# EAGLE design SMTRelayControllerDense (EAGLE 7.3.0)
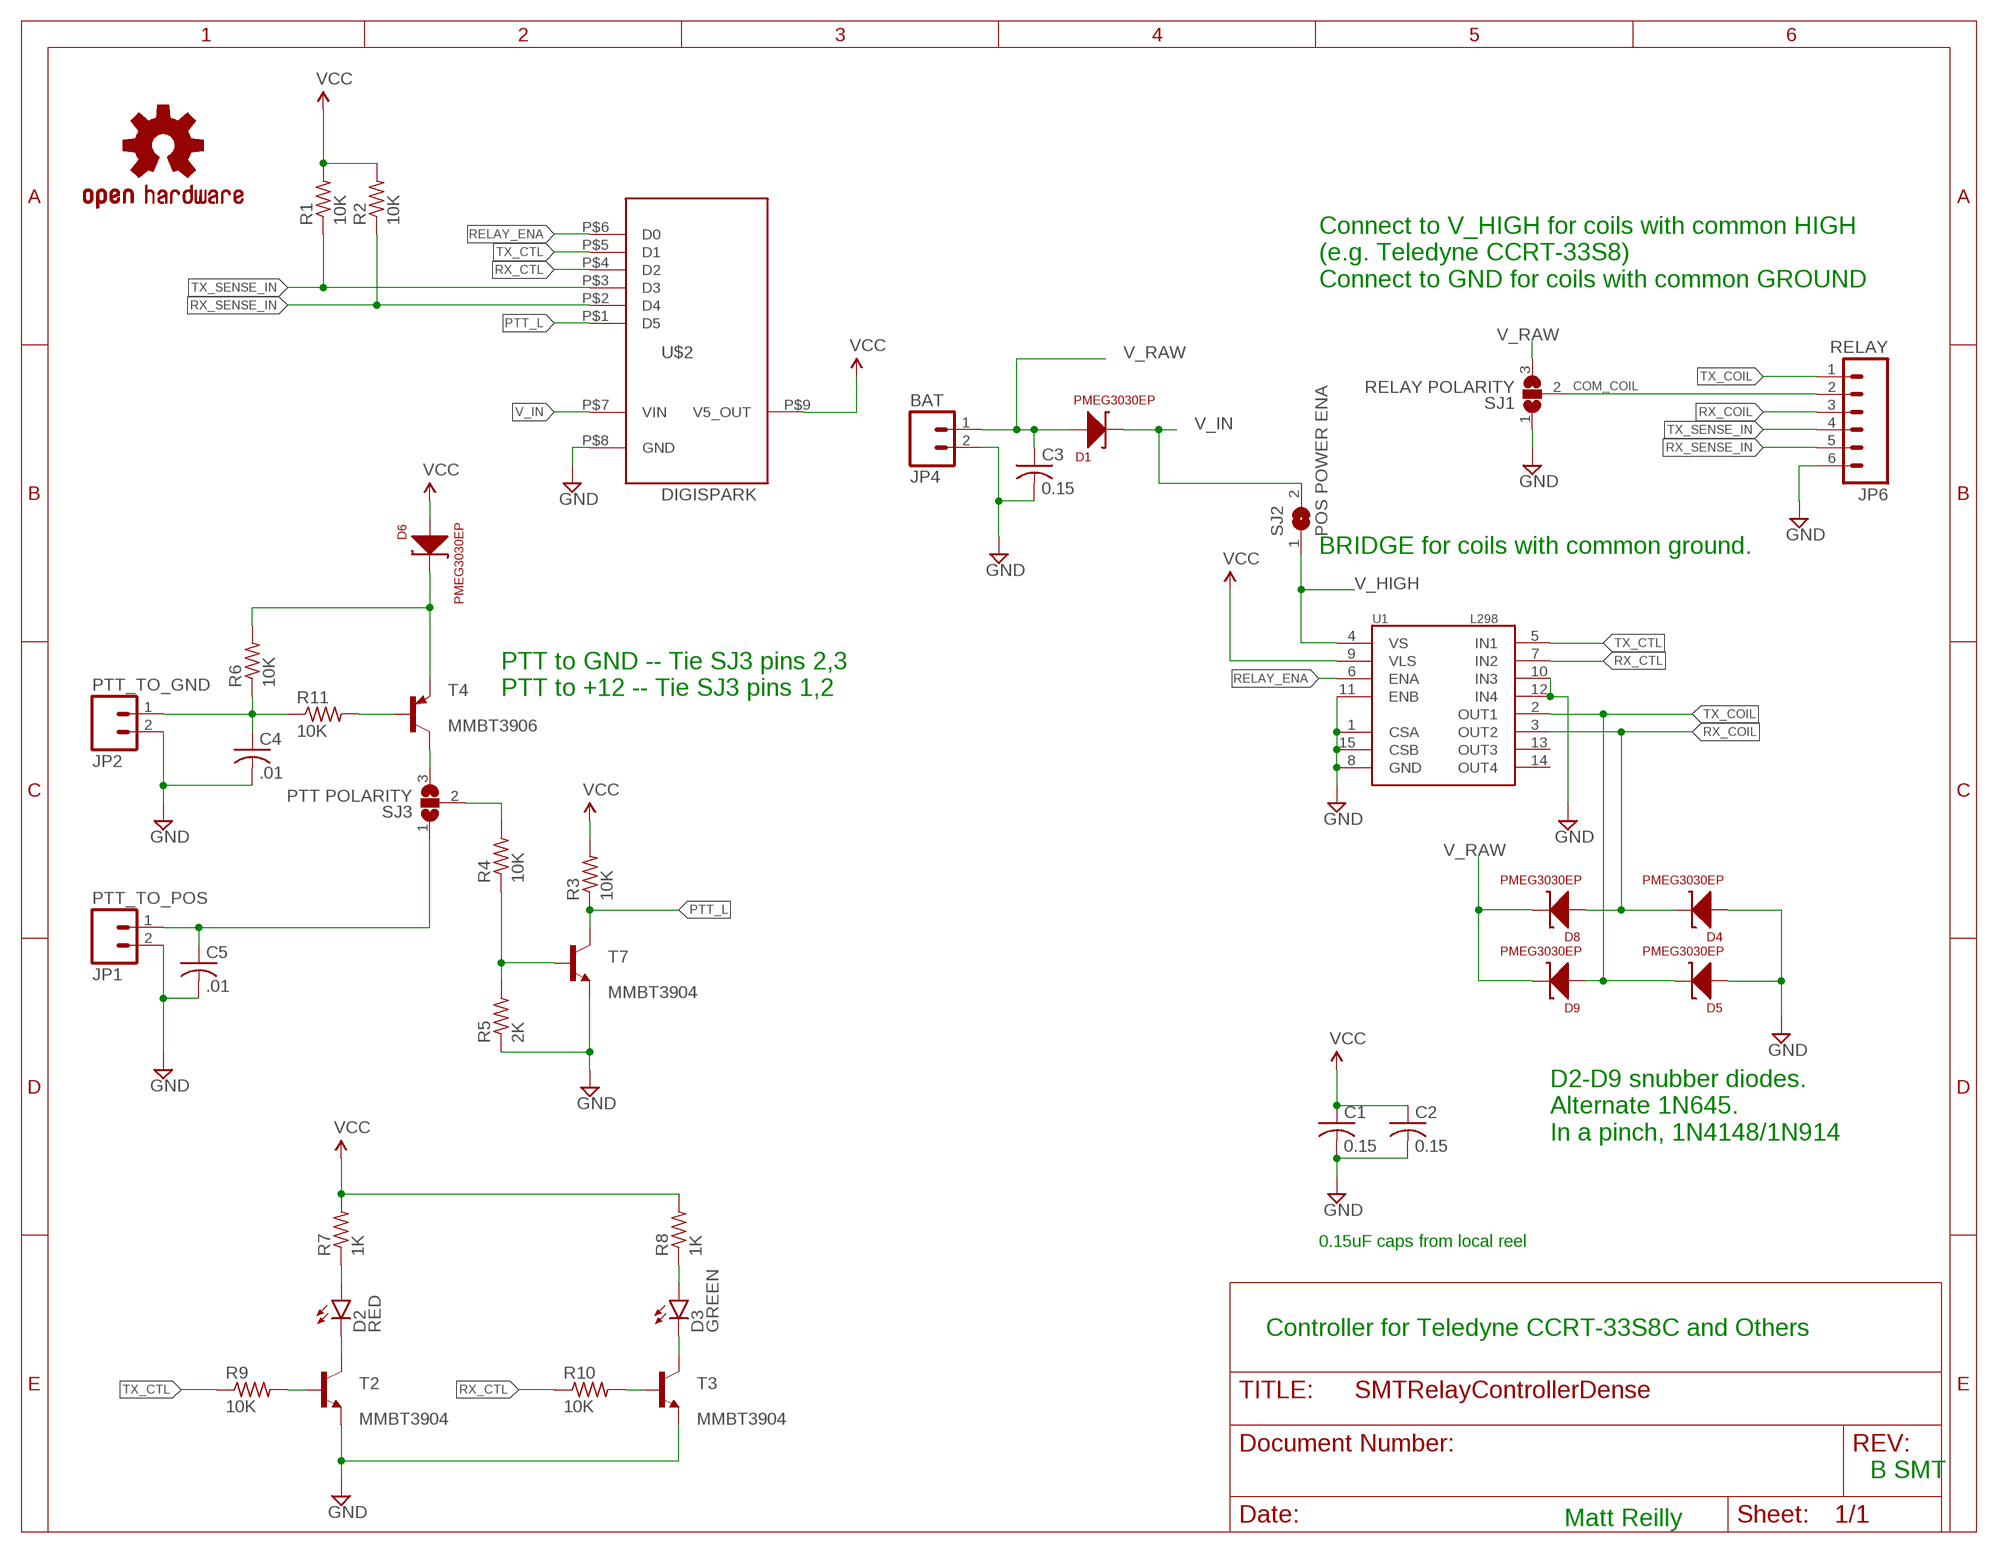
[diagram p0: schematic, sheet 1]

## Parts
C1  0.15  C-USC1206K  [C1206K]
C2  0.15  C-USC1206K  [C1206K]
C3  0.15  C-USC1206K  [C1206K]
C4  .01  C-USC1206K  [C1206K]
C5  .01  C-USC1206K  [C1206K]
D1  PMEG3030EP  [SOD128]
D2  RED  LED1206  [LED-1206]
D3  GREEN  LED1206  [LED-1206]
D4  PMEG3030EP  [SOD128]
D5  PMEG3030EP  [SOD128]
D6  PMEG3030EP  [SOD128]
D8  PMEG3030EP  [SOD128]
D9  PMEG3030EP  [SOD128]
JP1  PTT_TO_POS  M025MM  [SCREWTERMINAL-5MM-2]
JP2  PTT_TO_GND  M025MM  [SCREWTERMINAL-5MM-2]
JP4  BAT  M025MM  [SCREWTERMINAL-5MM-2]
JP6  RELAY  M06POLAR  [MOLEX-1X6]
LOGO2  OSHW-LOGOM  [OSHW-LOGO-M]
R1  10K  R-US_R1206  [R1206]
R2  10K  R-US_R1206  [R1206]
R3  10K  R-US_R1206  [R1206]
R4  10K  R-US_R1206  [R1206]
R5  2K  R-US_R1206  [R1206]
R6  10K  R-US_R1206  [R1206]
R7  1K  R-US_R1206  [R1206]
R8  1K  R-US_R1206  [R1206]
R9  10K  R-US_R1206  [R1206]
R10  10K  R-US_R1206  [R1206]
R11  10K  R-US_R1206  [R1206]
SJ1  RELAY POLARITY  SJ2WW  [SJ_2W]
SJ2  POS POWER ENA  SJW  [SJW]
SJ3  PTT POLARITY  SJ2WW  [SJ_2W]
T2  MMBT3904  MMBT3904LT1-NPN-SOT23-BEC  [SOT23-BEC]
T3  MMBT3904  MMBT3904LT1-NPN-SOT23-BEC  [SOT23-BEC]
T4  MMBT3906  MMBT3906LT1-PNP-SOT23-BEC  [SOT23-BEC]
T7  MMBT3904  MMBT3904LT1-NPN-SOT23-BEC  [SOT23-BEC]
U1  L298  [MULTIWATT15]
U$2  DIGISPARK  [DIGISPARK_FP]

## Nets
COM_COIL: JP6.2 SJ1.2
GND: C1.2 C2.2 C3.2 C4.2 C5.2 D4.P$1(A) D5.P$1(A) JP1.2 JP2.2 JP4.2 JP6.6 R5.1 SJ1.1 T2.E T3.E T7.E U1.1(CSA) U1.8(GND) U1.10(IN3) U1.11(ENB) U1.12(IN4) U1.15(CSB) U$2.P$8(GND)
N$1: C5.1 JP1.1 SJ3.1
N$2: R4.2 SJ3.2
N$3: D3.A R8.1
N$4: R4.1 R5.2 T7.B
N$5: R11.2 T4.B
N$6: D2.A R7.1
N$7: D2.C T2.C
N$8: D3.C T3.C
N$9: R9.2 T2.B
N$10: R10.2 T3.B
N$11: C4.1 JP2.1 R6.1 R11.1
N$12: D6.P$2(C) R6.2 T4.E
N$13: SJ3.3 T4.C
PTT_L: R3.1 T7.C U$2.P$1(D5)
RELAY_ENA: U1.6(ENA) U$2.P$6(D0)
RX_COIL: D4.P$2(C) D8.P$1(A) JP6.3 U1.3(OUT2)
RX_CTL: R10.1 U1.7(IN2) U$2.P$4(D2)
RX_SENSE_IN: JP6.5 R2.1 U$2.P$2(D4)
TX_COIL: D5.P$2(C) D9.P$1(A) JP6.1 U1.2(OUT1)
TX_CTL: R9.1 U1.5(IN1) U$2.P$5(D1)
TX_SENSE_IN: JP6.4 R1.1 U$2.P$3(D3)
V_HIGH: SJ2.1 U1.4(VS)
V_IN: D1.P$2(C) SJ2.2 U$2.P$7(VIN)
V_RAW: C3.1 D1.P$1(A) D8.P$2(C) D9.P$2(C) JP4.1 SJ1.3
VCC: C1.1 C2.1 D6.P$1(A) R1.2 R2.2 R3.2 R7.2 R8.2 U1.9(VLS) U$2.P$9(V5_OUT)
Unconnected: U1.13(OUT3) U1.14(OUT4)

## Notes on the sheet
- Connect to V_HIGH for coils with common HIGH
  (e.g. Teledyne CCRT-33S8)
  Connect to GND for coils with common GROUND
- BRIDGE for coils with common ground.
- PTT to GND -- Tie SJ3 pins 2,3
  PTT to +12 -- Tie SJ3 pins 1,2
- D2-D9 snubber diodes. 
  Alternate 1N645. 
  In a pinch, 1N4148/1N914
- 0.15uF caps from local reel
- Controller for Teledyne CCRT-33S8C and Others
- B SMT
- Matt Reilly

## Library data of the parts
C1-C5 = resistor:C-US: CAPACITOR, American symbol
D1 D4-D6 D8 D9 = kb1vc_robot_parts:PMEG3030EP
D2 D3 = SparkFun-LED:LED: LEDs Standard schematic elements and footprints for 5mm, 3mm, 1206, and 0603 sized LEDs. 5mm - Spark Fun Electronics SKU : COM-00529 (and others)
JP1 JP2 JP4 = SparkFun-Connectors:M02: Standard 2-pin 0.1" header. Use with - straight break away headers ( PRT-00116) - right angle break away headers (PRT-00553) - swiss pins (PRT-00743) - machine pins (PRT-00117) - female headers (PRT-00115) Molex polarized connector foot print use with: PRT-08233 with associated crimp pins and housings. 2.54_SCREWTERM for use with PRT-10571. 3.5mm Screw Terminal footprints for PRT-08084 5mm Screw Terminal footprints for use with PRT-08432; STOREFRONT_ID: PRT-08432
JP6 = SparkFun-Connectors:M06: Header 6 Standard 6-pin 0.1" header. Use with straight break away headers (SKU : PRT-00116), right angle break away headers (PRT-00553), swiss pins (PRT-00743), machine pins (PRT-00117), and female headers (PRT-00115). Molex polarized connector foot print use with SKU : PRT-08094 with associated crimp pins and housings. NOTES ON THE VARIANTS LOCK and LOCK_LONGPADS... This footprint was designed to help hold the alignment of a through-hole component (i.e. 6-pin header) while soldering it into place. You may notice that each hole has been shifted either up or down by 0.005 of an inch from it's more standard position (which is a perfectly straight line). This slight alteration caused the pins (the squares in the middle) to touch the edges of the holes. Because they are alternating, it causes a "brace" to hold the component in place. 0.005 has proven to be the perfect amount of "off-center" position when using our standard breakaway headers. Although looks a little odd when you look at the bare footprint, once you have a header in there, the alteration is very hard to notice. Also,if you push a header all the way into place, it is covered up entirely on the bottom side. This idea of altering the position of holes to aid alignment will be further integrated into the Sparkfun Library for other footprints. It can help hold any component with 3 or more connection pins.
LOGO2 = SparkFun-Aesthetics:OSHW-LOGO: Open Source Hardware Logo This logo indicates the piece of hardware it is found on incorporates a OSHW license and/or adheres to the definition of open source hardware found here: http://freedomdefined.org/OSHW
R1-R11 = rcl:R-US_: RESISTOR, American symbol
SJ1 SJ3 = jumper:SJ2W: SMD solder JUMPER
SJ2 = jumper:SJ: SMD solder JUMPER
T2 T3 T7 = transistor-neu-to92:*-NPN-: NPN Transistror
T4 = transistor-neu-to92:*-PNP-: PNP Transistror
U1 = SparkFun-PowerIC:L298: L298 Dual Full Bridge Driver
U$2 = kb1vc_Arduino_Parts:DIGISPARK: Digispark -- ATTiny arduino with minimal footprint

## Board
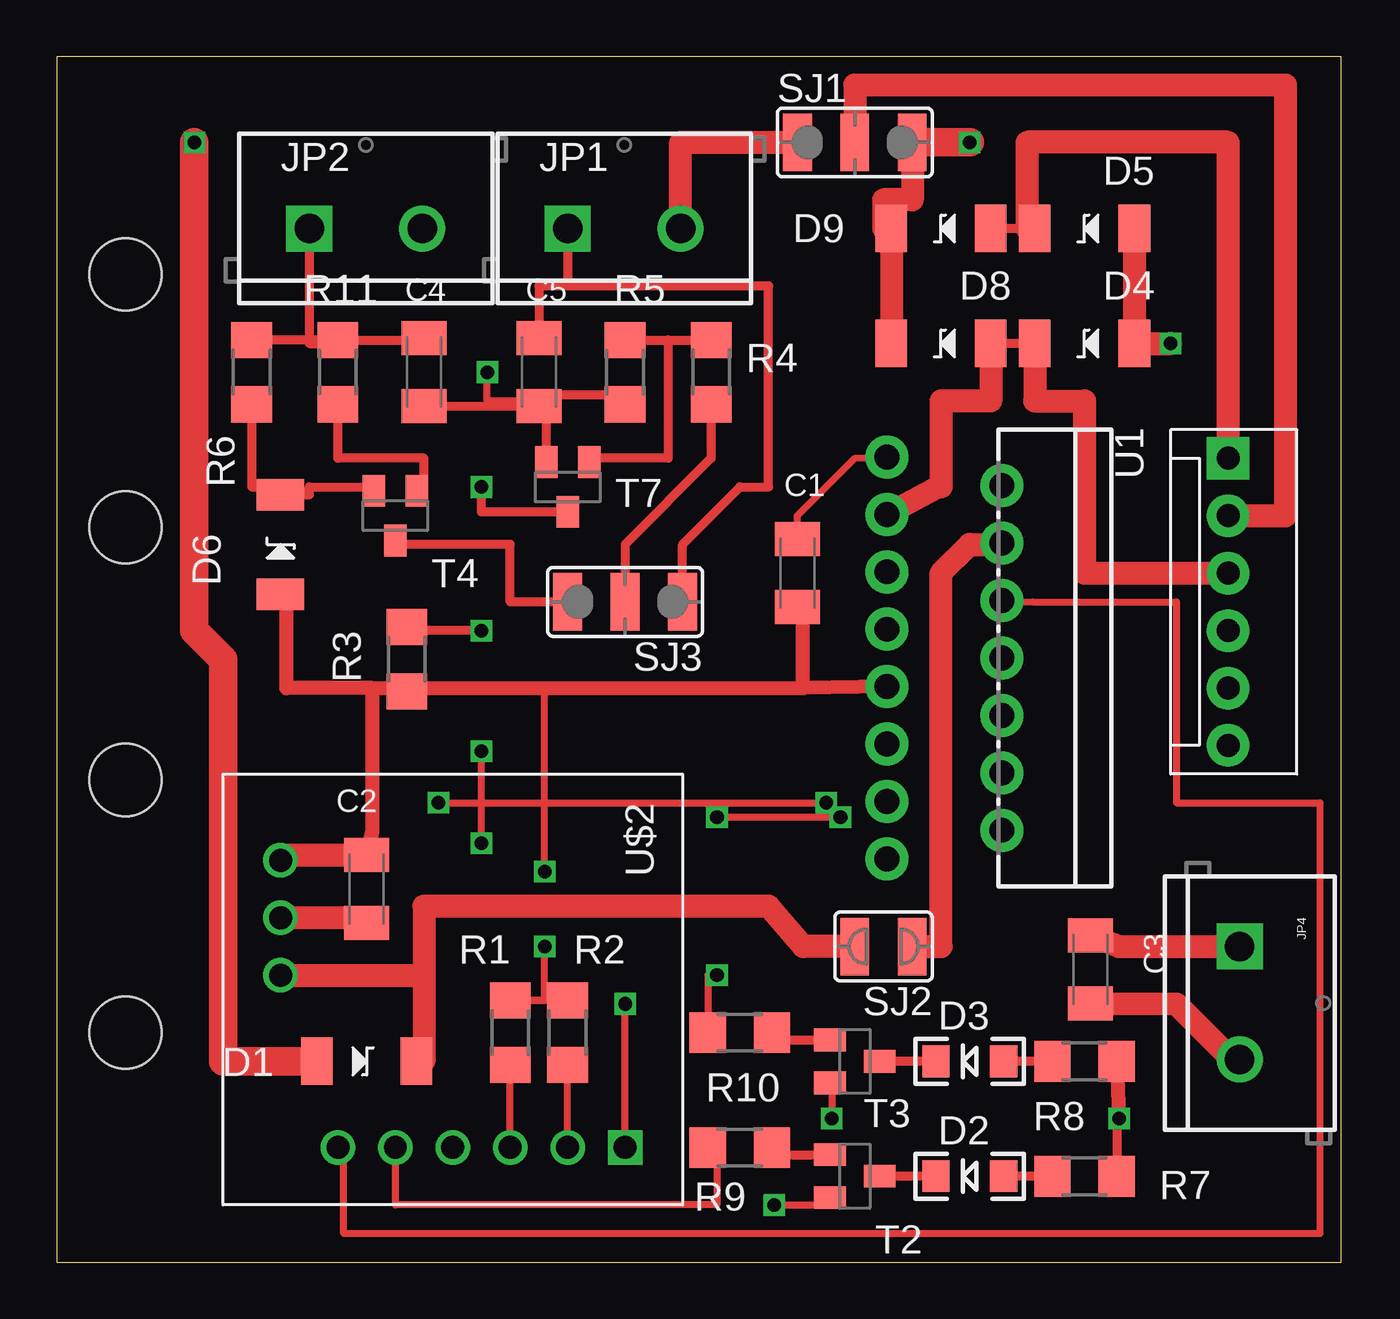
[diagram p1: board, top side]
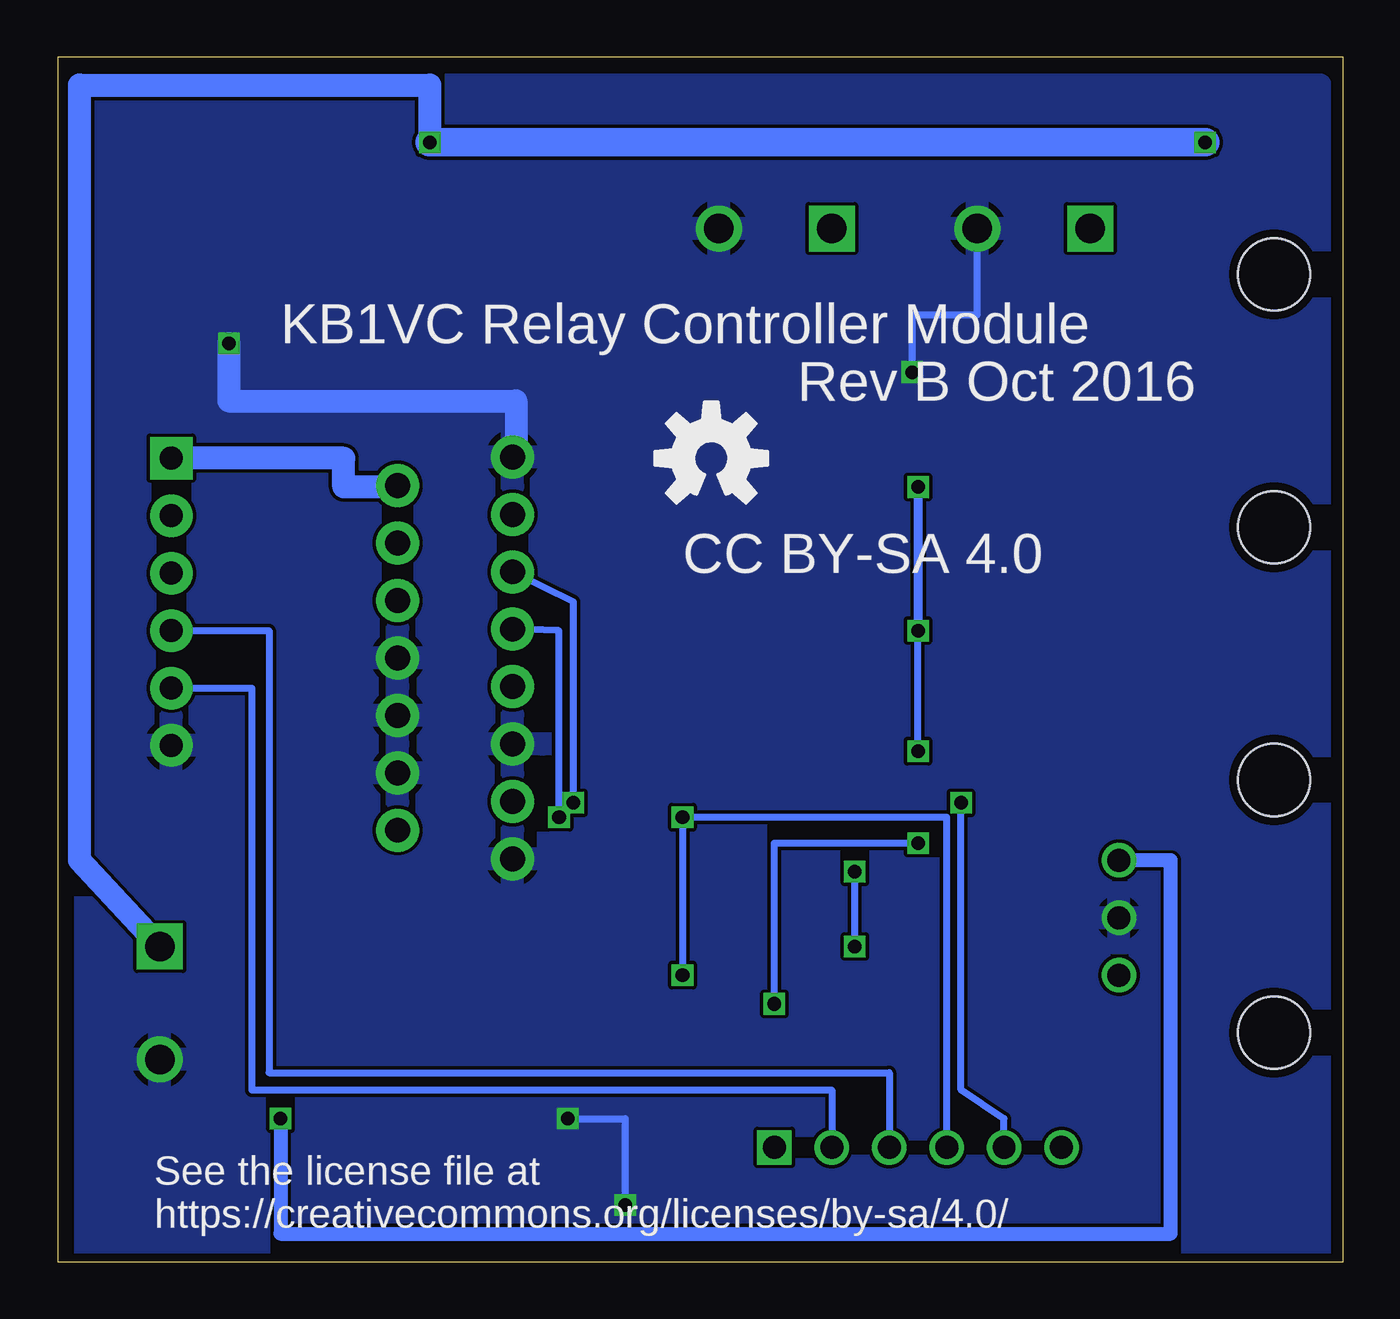
[diagram p2: board, bottom side, seen from below]

Size 56.82 x 53.33 mm. Coordinates in mm from the lower left corner, seen from the top.
Outline: 0,0 56.82,0 56.82,53.33 0,53.33 0,0
Copper layers (1*16): Top 0.0356mm / dielectric 1.5011mm / Bottom 0.0356mm
Design rules "oshpark-2layer": minimum track width 6mil, minimum drill 13mil, track to track 6mil, track to pad 6mil, pad to pad 6mil, via to via 6mil, smd to smd 6mil, copper to edge 15mil, drill to drill 6mil, minimum pad ring 7mil, minimum via ring 7mil, stop-mask expansion 2.5mil, vias tented up to drill 0mil, thermal gap 10mil
Holes 3.2 mm at 3.05,10.16 3.05,21.34 3.05,32.51 3.05,43.69

### Footprints (pad centres in the part's own frame; a part is rotated, then mirrored left to right if it is on the bottom)
C1206K = smd 1.5 x 2: 1 -1.5,0; 2 1.5,0
SOD128 = smd 1.4 x 2.1: P$1 -2.2,0; P$2 2.2,0
LED-1206 = smd 1.2 x 1.4: A -1.5,0; C 1.5,0
SCREWTERMINAL-5MM-2 = drill 1.3 pad 2.032 square: 1 0,0 | drill 1.3 pad 2.032: 2 5,0
MOLEX-1X6 = drill 1.016 pad 1.88 square: 1 0,0 | drill 1.016 pad 1.88: 2 2.54,0; 3 5.08,0; 4 7.62,0; 5 10.16,0; 6 12.7,0
R1206 = smd 1.6 x 1.803: 1 -1.422,0; 2 1.422,0
SJ_2W = smd 1.27 x 2.54: 1 -2.54,0; 2 0,0; 3 2.54,0
SJW = smd 1.27 x 2.54: 1 -1.27,0; 2 1.27,0
SOT23-BEC = smd 1 x 1.4: B -0.95,-1.1; C 0,1.1; E 0.95,-1.1
MULTIWATT15 = drill 1.1 pad 1.9: 1 -8.95,-2.39; 2 -7.68,2.69; 3 -6.41,-2.39; 4 -5.14,2.69; 5 -3.87,-2.39; 6 -2.6,2.69; 7 -1.33,-2.39; 8 -0.06,2.69; 9 1.21,-2.39; 10 2.48,2.69; 11 3.75,-2.39; 12 5.02,2.69; 13 6.29,-2.39; 14 7.56,2.69; 15 8.83,-2.39
DIGISPARK_FP = drill 1.016 square: P$1 6.35,6.35 | drill 1.016: P$2 6.35,3.81; P$3 6.35,1.27; P$4 6.35,-1.27; P$5 6.35,-3.81; P$6 6.35,-6.35; P$7 -1.27,-8.89; P$8 -3.81,-8.89; P$9 -6.35,-8.89

### Placement (x,y rotation side)
C1  32.77,30.48 90 top
C2  13.72,16.51 270 top
C3  45.72,12.95 270 top
C4  16.26,39.37 270 top
C5  21.34,39.37 270 top
D1  13.72,8.89 0 top
D2  40.39,3.81 180 top
D3  40.39,8.89 180 top
D4  45.47,40.64 180 top
D5  45.47,45.72 180 top
D6  9.91,31.75 90 top
D8  39.12,40.64 180 top
D9  39.12,45.72 180 top
JP1  22.61,45.72 0 top
JP2  11.18,45.72 0 top
JP4  52.32,13.97 270 top
JP6  51.82,35.56 270 top
LOGO2  27.94,35.56 0 bottom
R1  20.07,10.16 90 top
R2  22.61,10.16 90 top
R3  15.49,26.67 270 top
R4  28.96,39.37 270 top
R5  25.15,39.37 90 top
R6  8.64,39.37 270 top
R7  45.47,3.81 0 top
R8  45.47,8.89 0 top
R9  30.23,5.08 0 top
R10  30.23,10.16 0 top
R11  12.45,39.37 270 top
SJ1  35.31,49.53 0 top
SJ2  36.58,13.97 180 top
SJ3  25.15,29.21 180 top
T2  35.31,3.81 270 top
T3  35.31,8.89 270 top
T4  14.99,33.02 180 top
T7  22.61,34.29 180 top
U1  39.12,26.67 270 top
U$2  18.8,11.43 270 top

### Tracks (layer width: path | path; a pad name or v marks a point on that pad's centre or on a via)
COM_COIL
  Top 1.016: JP6.2 54.36,33.02 54.36,52.07 35.31,52.07 SJ1.2
GND  (via drill 0.6)
  Top 0.305: C1.2 32.77,33.02 35.31,35.56 U1.1 | T3.E 34.29,7.94 v34.29,6.35 | v31.75,2.54 34.21,2.54 T2.E | 25.15,38.35 21.59,38.35 21.59,38.1 19.05,38.1 v19.05,39.37
  Top 0.406: C4.2 C5.2 | R5.1 25.15,38.35 21.34,38.35 C5.2 | C5.2 21.66,37.87 T7.E
  Top 1.016: D5.P$1 D4.P$1 v49.28,40.64 | JP1.2 27.61,49.53 SJ1.1 | C2.2 13.72,15.24 U$2.P$8 | C3.2 49.53,11.43 51.99,8.97 JP4.2
  Bottom 0.305: v34.29,6.35 31.75,6.35 v31.75,2.54 | v19.05,39.37 19.05,41.91 16.18,41.91 JP2.2
  Bottom 1.016: v49.28,40.64 49.28,38.1 36.58,38.1 36.58,35.62 U1.1
  pour Bottom: 1.02,52.07 55.63,52.07 55.63,0 1.02,0
N$1
  Top 0.406: JP1.1 22.61,43.18 | 22.61,43.18 21.34,43.18 C5.1 | SJ3.1 27.69,31.75 30.23,34.29 31.5,34.29 31.5,43.18 22.61,43.18
N$2
  Top 0.406: R4.2 28.96,35.56 25.15,31.75 SJ3.2
N$3
  Top 0.406: R8.1 D3.A
N$4
  Top 0.406: 27.05,40.79 R4.1 | R5.2 27.05,40.79 | 27.05,40.79 27.05,35.56 23.56,35.56 T7.B
N$5
  Top 0.406: T4.B 16.26,34.12 16.26,35.56 12.45,35.56 R11.2
N$6
  Top 0.406: R7.1 D2.A
N$7
  Top 0.406: D2.C T2.C
N$8
  Top 0.406: D3.C T3.C
N$9
  Top 0.406: R9.2 31.65,4.76 T2.B
N$10
  Top 0.406: R10.2 31.65,9.84 T3.B
N$11
  Top 0.406: JP2.1 11.18,40.64 12.45,40.64 R11.1 | R11.1 R6.1 | R11.1 16.26,40.79 C4.1
N$12
  Top 0.406: R6.2 8.64,34.29 9.91,34.29 D6.P$2 11.18,33.95 11.18,34.29 14.04,34.29 T4.E
N$13
  Top 0.406: SJ3.3 20.07,29.21 20.07,31.75 14.99,31.75 T4.C
PTT_L  (via drill 0.6)
  Top 0.305: U$2.P$1 v25.15,11.43 | v18.8,18.54 v18.8,22.61
  Top 0.406: T7.C 18.8,33.19 v18.8,34.29 | v18.8,27.94 16.26,27.94 R3.1
  Bottom 0.305: v25.15,11.43 25.15,18.54 v18.8,18.54 | v18.8,22.61 v18.8,27.94
  Bottom 0.406: v18.8,34.29 v18.8,27.94
RELAY_ENA
  Top 0.305: U1.6 43.18,29.21 49.53,29.21 49.53,20.32 55.88,20.32 55.88,1.27 12.7,1.27 12.7,5.08 U$2.P$6
RX_COIL
  Top 0.406: D4.P$2 D8.P$1
  Top 1.016: D8.P$1 41.32,38.1 39.12,38.1 39.12,34.35 | 39.12,34.29 39.12,34.35 | 39.12,34.35 U1.3 | D4.P$2 43.27,38.1 45.47,38.1 45.47,30.48 JP6.3
RX_CTL  (via drill 0.6)
  Top 0.305: v34.67,19.68 v29.21,19.68 | v29.21,12.7 28.8,12.7 R10.1
  Bottom 0.305: U$2.P$4 17.53,19.68 v29.21,19.68 v29.21,12.7 | v34.67,19.68 34.67,27.94 U1.7
RX_SENSE_IN
  Top 0.305: U$2.P$2 R2.1
  Bottom 0.305: JP6.5 48.26,25.4 48.26,7.62 22.61,7.62 U$2.P$2
TX_COIL
  Top 0.406: D5.P$2 D9.P$1
  Top 1.016: JP6.1 51.82,49.53 42.93,49.53 42.93,45.72 D5.P$2
  Bottom 1.016: U1.2 41.81,34.29 44.2,34.29 44.2,35.56 JP6.1
TX_CTL  (via drill 0.6)
  Top 0.305: v16.89,20.32 v34.04,20.32 | R9.1 29.21,5.08 29.21,2.54 14.99,2.54 U$2.P$5
  Bottom 0.305: U$2.P$5 14.99,6.35 16.89,7.62 v16.89,20.32 | v34.04,20.32 34.04,29.21 U1.5
TX_SENSE_IN
  Top 0.305: U$2.P$3 R1.1
  Bottom 0.305: JP6.4 47.5,27.94 47.5,8.38 20.07,8.38 U$2.P$3
V_HIGH
  Top 1.016: SJ2.1 39.12,13.97 39.12,30.48 40.39,31.75 41.75,31.75 U1.4
V_IN
  Top 1.016: SJ2.2 33.02,13.97 31.5,15.75 16.26,15.75 16.26,12.7 | 16.26,12.7 16.26,8.89 D1.P$2 | U$2.P$7 16.26,12.7
V_RAW  (via drill 0.6)
  Top 1.016: D8.P$2 D9.P$2 36.58,45.72 36.58,46.99 37.85,46.99 SJ1.3 | C3.1 46.99,13.97 JP4.1
  Top 1.27: D1.P$1 7.37,8.89 7.37,26.67 6.1,27.94 v6.1,49.53 | v40.39,49.53 SJ1.3
  Bottom 1.016: JP4.1 55.88,17.78 55.88,52.07 40.39,52.07 v40.39,49.53
  Bottom 1.27: v6.1,49.53 v40.39,49.53
VCC  (via drill 0.6)
  Top 0.305: R2.2 R1.2 21.59,11.58 v21.59,13.97 | v21.59,17.27 21.59,25.4 | R3.2 10.16,25.25 10.16,25.4
  Top 0.406: R8.2 R7.2
  Top 0.61: C2.1 13.97,19.05 13.97,25.4 | 13.97,25.4 21.59,25.4 33.02,25.4 | 33.02,25.4 33.02,29.21 C1.1 | U1.9 33.02,25.4 | 13.97,25.4 10.16,25.4 10.16,29.21 D6.P$1 | R8.2 v46.99,6.35
  Top 1.016: U$2.P$9 9.91,18.01 C2.1
  Bottom 0.305: v21.59,13.97 v21.59,17.27
  Bottom 0.61: v46.99,6.35 46.99,1.27 7.62,1.27 7.62,17.78 U$2.P$9

### Text on the board
bPlace: KB1VC Relay Controller Module | Rev B Oct 2016 | CC BY-SA 4.0 | See the license file at / https://creativecommons.org/licenses/by-sa/4.0/
tDocu: PTT2GND | PTT2PLUS | https://github.com/kb1vc/RelayControl | +V | RF Relay / Controller | Rev B_SMT | GND | CC-BY-SA | M. H. Reilly | 2016